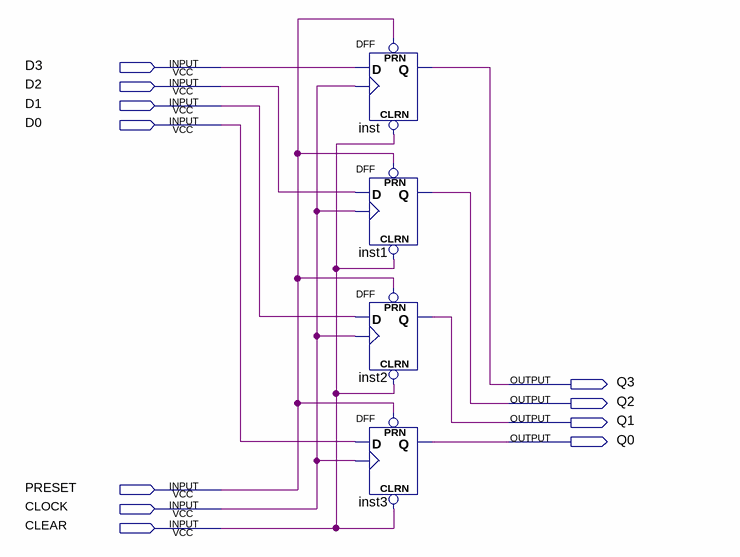
[diagram p0: schematic sheet]
// Quartus schematic shift_register.bdf as structural Verilog: 4 symbols, 11 pins
module shift_register (
  input  D3,
  input  D2,
  input  D1,
  input  D0,
  input  PRESET,
  input  CLOCK,
  input  CLEAR,
  output Q3,
  output Q2,
  output Q1,
  output Q0
);

  DFF inst (.CLRN(CLEAR), .CLK(CLOCK), .D(D3), .PRN(PRESET), .Q(Q3));
  DFF inst1 (.CLRN(CLEAR), .CLK(CLOCK), .D(D2), .PRN(PRESET), .Q(Q2));
  DFF inst2 (.CLRN(CLEAR), .CLK(CLOCK), .D(D1), .PRN(PRESET), .Q(Q1));
  DFF inst3 (.CLRN(CLEAR), .CLK(CLOCK), .D(D0), .PRN(PRESET), .Q(Q0));
endmodule
